# EAGLE design MoteinoM0CAM-M8 (EAGLE 9.4.2)
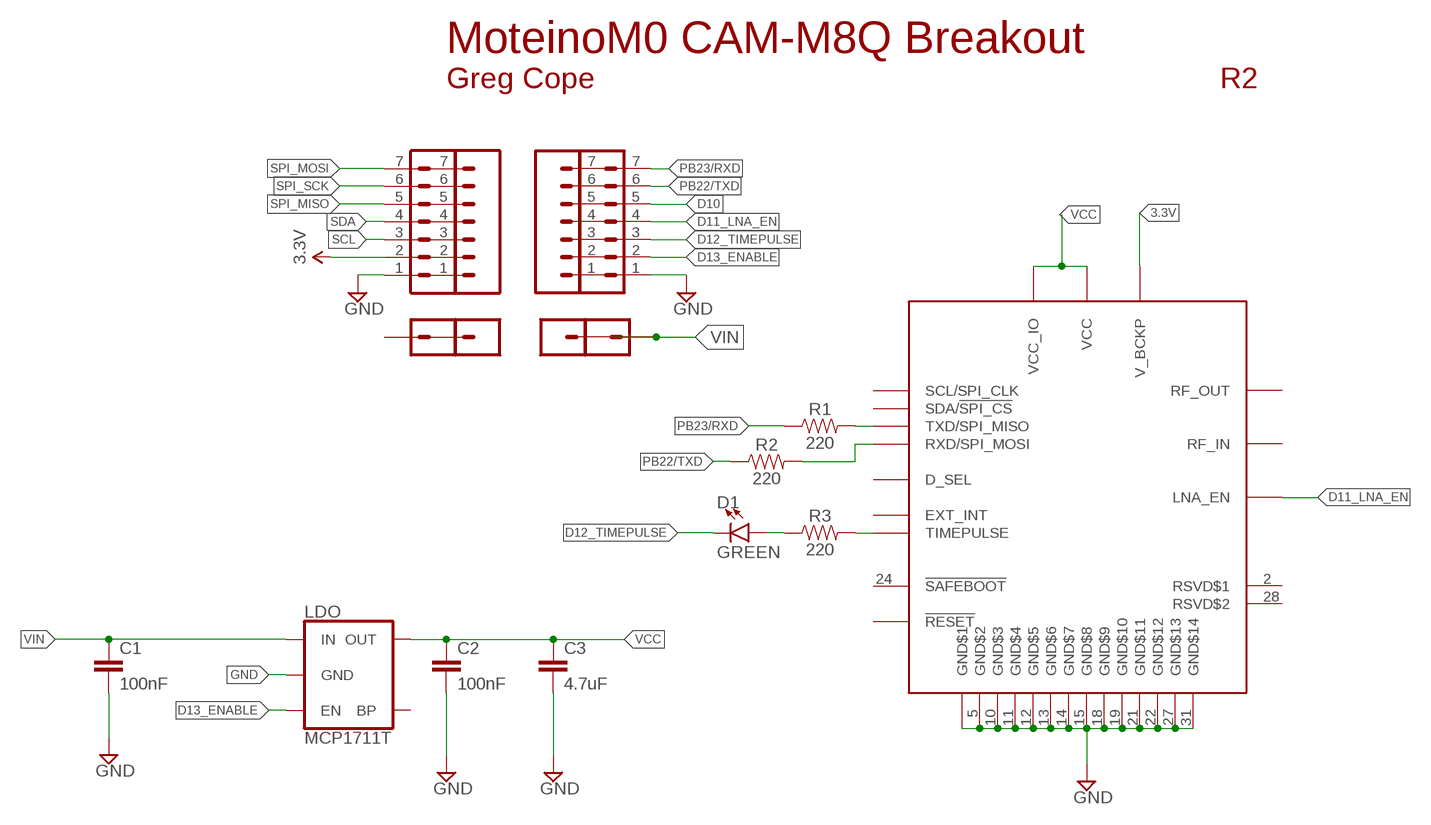
[diagram p0: schematic, sheet 1]

## Parts
C1  100nF  0.1UF-0603-25V-5%  [0603]
C2  100nF  0.1UF-0603-25V-5%  [0603]
C3  4.7uF  4.7UF0603  [0603]
D1  GREEN  LED-GREEN0603  [LED-0603]
J1  CONN_01  [1X01]
J2  CONN_01  [1X01]
J3  CONN_01  [1X01]
J4  CONN_01  [1X01]
LDO  MCP1711T  V_REG_SPX3819-SOT23-5  [SOT23-5]
R1  220  220OHM-0603-1/10W-1%  [0603]
R2  220  220OHM-0603-1/10W-1%  [0603]
R3  220  220OHM-0603-1/10W-1%  [0603]
U$1  CAM-M8  [CAM-M8]
U$4  HDR_7PINNS_THINRINGS  [1X07_NS_THINRINGS]
U$10  HDR_7PINNS_THINRINGS  [1X07_NS_THINRINGS]
U$17  HDR_7PINHH  [1X07_NS_THINRINGS_HH]
U$18  HDR_7PINHH  [1X07_NS_THINRINGS_HH]

## Nets
3.3V: U$1.8(V_BCKP) U$18.2
D10: U$17.5
D11_LNA_EN: U$1.30(LNA_EN) U$17.4
D12_TIMEPULSE: D1.C U$17.3
D13_ENABLE: LDO.3(EN) U$17.2
GND: C1.2 C2.2 C3.2 LDO.2(GND) U$1.4(GND$1) U$1.5(GND$2) U$1.10(GND$3) U$1.11(GND$4) U$1.12(GND$5) U$1.13(GND$6) U$1.14(GND$7) U$1.15(GND$8) U$1.18(GND$9) U$1.19(GND$10) U$1.21(GND$11) U$1.22(GND$12) U$1.27(GND$13) U$1.31(GND$14) U$17.1 U$18.1
N$1: R3.2 U$1.29(TIMEPULSE)
N$2: R1.2 U$1.25(TXD/SPI_MISO)
N$3: R2.2 U$1.26(RXD/SPI_MOSI)
N$4: D1.A R3.1
PB22/TXD: R2.1 U$17.6
PB23/RXD: R1.1 U$17.7
SCL: U$18.3
SDA: U$18.4
SPI_MISO: U$18.5
SPI_MOSI: U$18.7
SPI_SCK: U$18.6
VCC: C2.1 C3.1 LDO.5(OUT) U$1.1(VCC_IO) U$1.9(VCC)
VIN: C1.1 J3.1 J4.1 LDO.1(IN)
Unconnected: J1.1 J2.1 LDO.4(BP) U$1.2(RSVD$1) U$1.3(SDA/!SPI_CS) U$1.6(SCL/SPI_CLK) U$1.7(EXT_INT) U$1.16(RF_OUT) U$1.17(RF_IN) U$1.20(D_SEL) U$1.23(!RESET) U$1.24(!SAFEBOOT) U$1.28(RSVD$2) U$4.1 U$4.2 U$4.3 U$4.4 U$4.5 U$4.6 U$4.7 U$10.1 U$10.2 U$10.3 U$10.4 U$10.5 U$10.6 U$10.7

## Notes on the sheet
- MoteinoM0 CAM-M8Q Breakout
- Greg Cope | R2

## Library data of the parts
C1 C2 = SparkFun-Capacitors:0.1UF: 0.1µF ceramic capacitors A capacitor is a passive two-terminal electrical component used to store electrical energy temporarily in an electric field.; PROD_ID: CAP-08604; VALUE: 0.1uF
C3 = SparkFun-Capacitors:4.7UF: 4.7µF ceramic capacitors A capacitor is a passive two-terminal electrical component used to store electrical energy temporarily in an electric field.; PROD_ID: CAP-08280
D1 = SparkFun-LED:LED-GREEN: Green SMD LED Used in manufacturing of various products at SparkFun Packages: 0603 - SMD 0603 package [Product Link] <http://www.futureelectronics.com/en/technologies/semiconductors/optoelectronics/leds/Pages/9894312-LTST-C190GKT.aspx?CrossPart=HSMG-C190&IM=0> LilyPad 1206 - SMD1206 LilyPad package [Product Link] <http://www.futureelectronics.com/en/Technologies/Product.aspx?ProductID=IN150NGHARVATEKCORPORATION2049943&IM=0> 1206 - SMD1206 package [Product Link] <http://www.futureelectronics.com/en/technologies/semiconductors/optoelectronics/leds/Pages/8315665-LTST-C150KGKT.aspx?IM=0> 1206 Bottom Mount -SMD 1206 Bottom Mount [Product Link] <http://www.digikey.com/product-detail/en/lite-on-inc/LTST-C230KGKT/160-1456-1-ND/386854> SparkFun Products: Pro Mini 328 -5V <https://www.sparkfun.com/products/821> RedBoard <https://www.sparkfun.com/products/12757> MP3 Trigger <https://www.sparkfun.com/products/13720> Makey Makey <https://www.sparkfun.com/products/11076>; PROD_ID: DIO-00821
J1-J4 = SparkFun-Connectors:CONN_01: Single connection point. Often used as Generic Header-pin footprint for 0.1 inch spaced/style header connections On any of the 0.1 inch spaced packages, you can populate with these: Break Away Headers - Straight <https://www.sparkfun.com/products/116> (PRT-00116) Break Away Male Headers - Right Angle <https://www.sparkfun.com/products/553> (PRT-00553) Female Headers <https://www.sparkfun.com/products/115> (PRT-00115) Break Away Headers - Machine Pin <https://www.sparkfun.com/products/117> (PRT-00117) Break Away Female Headers - Swiss Machine Pin <https://www.sparkfun.com/products/743> (PRT-00743) This device is also useful as a general connection point to wire up your design to another part of your project. Our various solder wires solder well into these plated through hole pads. Hook-Up Wire - Assortment (Stranded, 22 AWG) <https://www.sparkfun.com/products/11375> (PRT-11375) Hook-Up Wire - Assortment (Solid Core, 22 AWG) <https://www.sparkfun.com/products/11367> (PRT-11367) View the entire wire category on our website here <https://www.sparkfun.com/categories/141> Special notes: SMTSO-256-ET is a "flush mount" nut for a 4-40 screw. We mostly use this on specialty testbeds; it is a nice way to connect hardware to your PCB at an adjustable hieght. Also note, the SNAP packages are for using a snappable style connector. We sell a baggie of snaps and they are also used on two LilyPad designs: Snap Assortment - 30 pack (male and female) <https://www.sparkfun.com/products/11347> (DEV-11347) LilyPad Arduino SimpleSnap <https://www.sparkfun.com/products/10941> (DEV-10941) LilyPad SimpleSnap Protoboard <https://www.sparkfun.com/products/10940> (DEV-10940)
LDO = SparkFun-IC-Power:V_REG_SPX3819: SPX3819 Voltage Regulator 3.3V 500mA, 16V input Datasheet <https://www.exar.com/content/document.ashx?id=22106> SparkFun Products: SparkFun Serial Controlled Motor Driver <https://www.sparkfun.com/products/13911>; PROD_ID: VREG-13321; VALUE: SPX3819M5_3_3
R1-R3 = SparkFun-Resistors:220OHM: 220Ω resistor A resistor is a passive two-terminal electrical component that implements electrical resistance as a circuit element. Resistors act to reduce current flow, and, at the same time, act to lower voltage levels within circuits. - Wikipedia; PROD_ID: RES-07861
U$1 = ubloxLib:CAM-M8: CAM-M8x: M8 Concurrent GNSS Antenna Module u-blox.com
U$4 U$10 U$17 U$18 = LowPowerLab:HDR_7PIN

## Net classes
1 power: width 0.381 mm, clearance 0.254 mm
2 pour: width 0.254 mm, clearance 0.254 mm

## Board
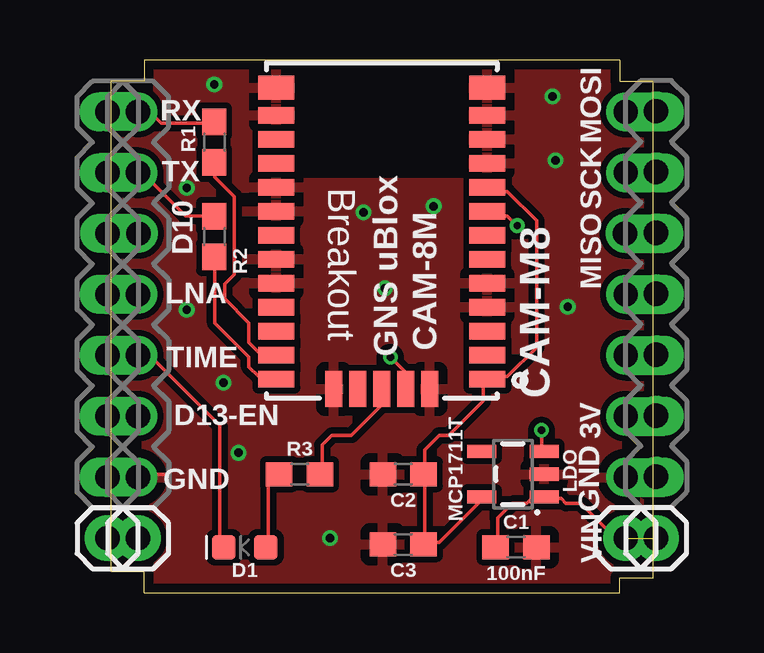
[diagram p1: board, top side]
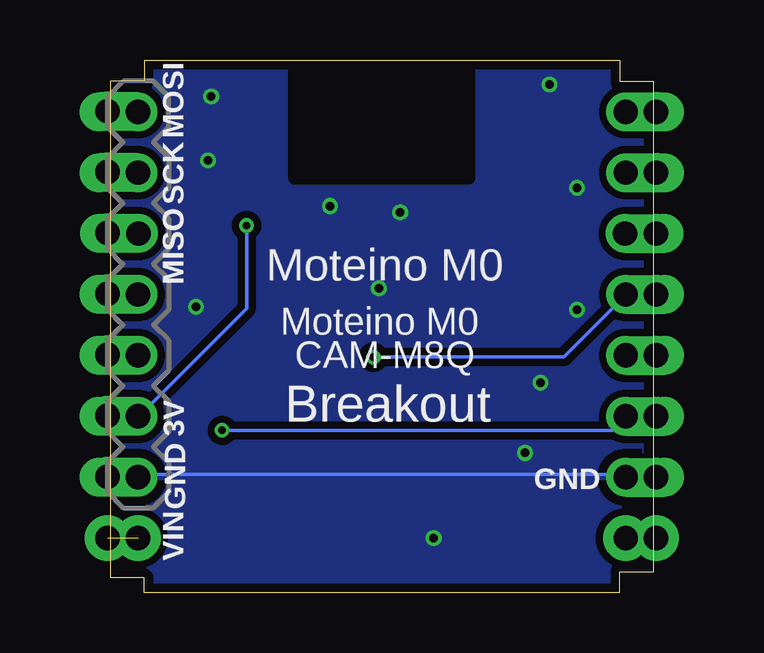
[diagram p2: board, bottom side, seen from below]

Size 22.61 x 22.23 mm. Coordinates in mm from the lower left corner, seen from the top.
Outline: 0,21.34 0,0.89 1.4,0.89 1.4,0 21.21,0 21.21,0.64 22.61,0.64 22.61,21.34 21.21,21.34 21.21,22.23 1.4,22.23 1.4,21.34 0,21.34
Copper layers (1*16): Top 0.0356mm / dielectric 1.5011mm / Bottom 0.0356mm
Design rules "LaenPCBOrder *": minimum track width 6mil, minimum drill 12mil, track to track 10mil, track to pad 10mil, pad to pad 6mil, via to via 6mil, smd to smd 6mil, copper to edge 15mil, drill to drill 10mil, minimum pad ring 10mil, minimum via ring 6mil, stop-mask expansion 2mil, vias tented up to drill 25mil, thermal gap 15mil
tRestrict: area 6.1,20.4 to 7.7,20.4; area 6.1,13.4 to 7.7,13.4; area 6.1,16.4 to 7.7,16.4; area 14.9,18.4 to 16.5,18.4; area 14.9,19.4 to 16.5,19.4; area 14.9,20.4 to 16.5,20.4; area 14.9,12.4 to 16.5,12.4

### Footprints (pad centres in the part's own frame; a part is rotated, then mirrored left to right if it is on the bottom)
0603 = smd 1.1 x 1: 1 -0.85,0; 2 0.85,0
LED-0603 = smd 1 x 1: A -0.877,0; C 0.877,0
1X01 = drill 1.016 pad 1.88: 1 0,0
SOT23-5 = smd 0.55 x 1.2: 1 -0.95,-1.3; 2 0,-1.3; 3 0.95,-1.3; 4 0.95,1.3; 5 -0.95,1.3
CAM-M8 = smd 0.7 x 1.5: 1 -6.2,-4.4; 2 -5.2,-4.4; 3 -4.2,-4.4; 4 -3.2,-4.4; 5 -2.2,-4.4; 6 -1.2,-4.4; 7 -0.2,-4.4; 8 0.8,-4.4; 9 1.8,-4.4; 10 2.8,-4.4; 11 3.8,-4.4; 12 4.8,-4.4; 15 4.8,4.4; 16 3.8,4.4; 17 2.8,4.4; 18 1.8,4.4; 19 0.8,4.4; 20 -0.2,4.4; 21 -1.2,4.4; 22 -2.2,4.4; 23 -3.2,4.4; 24 -4.2,4.4; 25 -5.2,4.4; 26 -6.2,4.4 | smd 1 x 1.5: 13 5.95,-4.4; 14 5.95,4.4 | smd 1.5 x 0.7: 27 -6.6,2; 28 -6.6,1; 29 -6.6,0; 30 -6.6,-1; 31 -6.6,-2
1X07_NS_THINRINGS = drill 1.016 pad 1.626: 1 0,0; 2 2.54,0; 3 5.08,0; 4 7.62,0; 5 10.16,0; 6 12.7,0; 7 15.24,0
1X07_NS_THINRINGS_HH = drill 1.016 pad 1.626 offset: 1 0,0; 2 2.54,0; 3 5.08,0; 4 7.62,0; 5 10.16,-0.025; 6 12.7,0; 7 15.24,0

### Placement (x,y rotation side)
C1  16.89,1.91 0 top
C2  12.19,4.95 180 top
C3  12.19,2.03 180 top
D1  5.59,1.91 180 top
J1  1.14,2.29 0 top
J2  -0.13,2.29 0 top
J3  22.73,2.29 0 top
J4  21.46,2.29 0 top
LDO  16.76,4.95 90 top
R1  4.32,18.8 270 top
R2  4.32,14.86 270 top
R3  7.87,4.95 0 top
U$1  11.3,15.11 90 top
U$4  22.73,4.85 90 top
U$10  -0.13,4.83 90 top
U$17  1.14,4.83 90 top
U$18  21.46,4.83 90 bottom

### Tracks (layer width: path | path; a pad name or v marks a point on that pad's centre or on a via)
3.3V  (via drill 0.3)
  Top 0.152: v16.94,15.32 16.54,15.72 15.72,15.72 U$1.8
  Bottom 0.152: v16.94,15.32 16.94,11.86 21.41,7.39 U$18.2
D11_LNA_EN  (via drill 0.3)
  Top 0.152: v11.66,9.83 12.27,9.22 12.27,8.61 U$1.30
  Bottom 0.152: v11.66,9.83 3.73,9.83 1.29,12.27 U$17.4
D12_TIMEPULSE
  Top 0.152: U$17.3 1.29,9.83 1.7,9.83 4.55,6.99 4.55,1.91 D1.C
D13_ENABLE  (via drill 0.3)
  Top 0.152: v17.96,6.78 17.96,5.97 LDO.3
  Bottom 0.152: v17.96,6.78 1.7,6.78 1.29,7.19 U$17.2
GND  (via drill 0.35)
  Top 0.152: U$17.1 1.29,4.95 2.31,4.95 2.41,4.78
  Bottom 0.152: U$17.1 1.29,4.95 21.41,4.95 U$18.1
  other vias: 10.54,15.88 13.46,16.13 11.43,12.7 18.54,18.03 19.05,11.94 9.14,2.29 5.33,5.84 4.7,8.76 3.17,11.81 3.17,16.89 4.32,21.21 18.42,20.7
  pour Top: 22.73,22.23 -0.23,22.23 -0.56,-0.08 22.68,-0.08
  pour Bottom (isolate 0.305): 0,22.35 22.73,22.35 22.73,21.21 22.73,0.13 0,0.13 0,0.76
N$1
  Top 0.152: R3.2 8.81,4.95 8.81,6.17 9.22,6.58 10.03,6.58 11.25,7.8 11.25,8.41 U$1.29
N$2
  Top 0.152: R1.2 4.34,17.75 4.34,17.35 5.16,16.54 5.16,13.28 4.75,12.88 4.75,12.27 5.77,11.25 5.77,10.44 6.17,10.03 6.78,10.03 U$1.25
N$3
  Top 0.152: R2.2 4.34,13.89 4.34,11.25 5.77,9.83 5.77,9.42 6.17,9.02 6.78,9.02 U$1.26
N$4
  Top 0.152: D1.A 6.58,1.91 6.58,4.55 6.99,4.95 R3.1
PB22/TXD
  Top 0.152: R2.1 4.14,15.72 3.12,15.72 1.29,17.55 U$17.6
PB23/RXD
  Top 0.152: R1.1 4.14,19.58 2.11,19.58 1.7,19.99 1.29,19.99 U$17.7
VCC
  Top 0.152: 13.08,4.95 13.08,2.11 | 13.08,2.11 13.69,2.11 15.32,3.73 15.32,3.94 LDO.5 | 13.08,2.11 C3.1 | 13.08,4.95 13.08,5.97 13.69,6.58 14.1,6.58 15.52,8 15.52,8.81 U$1.1 15.72,9.02 16.54,9.02 17.76,10.24 17.76,15.52 16.54,16.74 15.72,16.74 U$1.9 | 13.08,4.95 C2.1
VIN  (1 unrouted)
  Top 0.152: C1.1 16.13,1.91 16.13,3.12 16.74,3.73 17.35,3.73 17.55,3.94 17.96,3.94 LDO.1 18.16,3.94 18.77,3.94 18.97,3.73 19.58,3.73 21.01,2.31 21.41,2.31 J4.1

### Text on the board
tPlace: RX | MOSI | TX | Breakout | SCK | D10 | GNS uBlox | MISO | CAM-8M | LNA | TIME | D13-EN | 3V | GND | GND | VIN
bPlace: MOSI | SCK | MISO | MISO | Moteino M0 | Moteino M0 | CAM-M8Q | Breakout | 3V | GND | GND | VIN